# Altium project stepmotor.PrjPcb
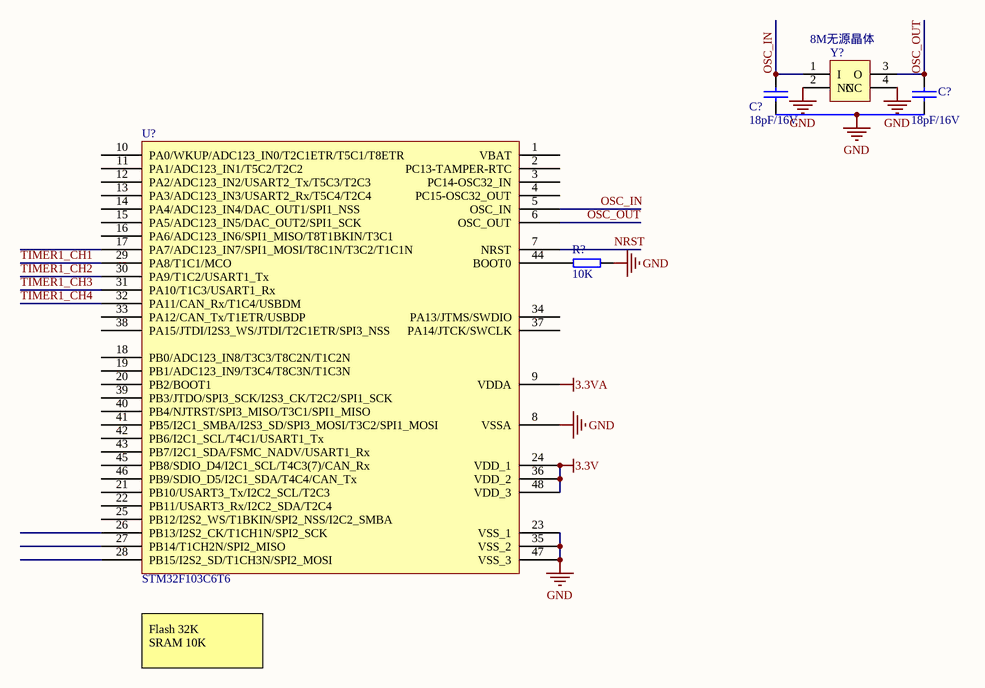
[diagram p0: mcu.SchDoc]
2 sheets, 34 parts. Net scope: global (net labels, ports and power ports of the same name join across sheets).
Sheets:
  mcu.SchDoc
  power.SchDoc

## Sheet mcu.SchDoc
size A3; SheetNumber: 1; SheetTotal: 2

### Parts
(Parts that share a designator on the sheet are numbered #1, #2 ... from top to bottom, then left to right.)
C?#1  18pF/16V  [C0402]
C?#2  18pF/16V  [C0402]
R?#1  10K  [R0603]
U?#1  STM32F103C6T6  [LQFP-48_M]
Y?  8M无源晶体  [5032 4pin]

### Nets
3.3V: U?#1.24(VDD_1) U?#1.36(VDD_2) U?#1.48(VDD_3)
3.3VA: U?#1.9(VDDA)
GND: C?#1.1 C?#2.1 R?#1.1 U?#1.8(VSSA) U?#1.23(VSS_1) U?#1.35(VSS_2) U?#1.47(VSS_3) Y?.2(NC) Y?.4(NC)
NRST: U?#1.7(NRST)
OSC_IN: C?#1.2 U?#1.5(OSC_IN) Y?.1(I)
OSC_OUT: C?#2.2 U?#1.6(OSC_OUT) Y?.3(O)
TIMER1_CH1: U?#1.29(PA8/T1C1/MCO)
TIMER1_CH2: U?#1.30(PA9/T1C2/USART1_Tx)
TIMER1_CH3: U?#1.31(PA10/T1C3/USART1_Rx)
TIMER1_CH4: U?#1.32(PA11/CAN_Rx/T1C4/USBDM)
NetR?#1_2: R?#1.2 U?#1.44(BOOT0)

Not connected (* = marked no-connect by the designer): U?#1 1(VBAT) 2(PC13-TAMPER-RTC) 3(PC14-OSC32_IN) 4(PC15-OSC32_OUT) 10(PA0/WKUP/ADC123_IN0/T2C1ETR/T5C1/T8ETR) 11(PA1/ADC123_IN1/T5C2/T2C2) 12(PA2/ADC123_IN2/USART2_Tx/T5C3/T2C3) 13(PA3/ADC123_IN3/USART2_Rx/T5C4/T2C4) 14(PA4/ADC123_IN4/DAC_OUT1/SPI1_NSS) 15(PA5/ADC123_IN5/DAC_OUT2/SPI1_SCK) 16(PA6/ADC123_IN6/SPI1_MISO/T8T1BKIN/T3C1) 17(PA7/ADC123_IN7/SPI1_MOSI/T8C1N/T3C2/T1C1N) 18(PB0/ADC123_IN8/T3C3/T8C2N/T1C2N) 19(PB1/ADC123_IN9/T3C4/T8C3N/T1C3N) 20(PB2/BOOT1) 21(PB10/USART3_Tx/I2C2_SCL/T2C3) 22(PB11/USART3_Rx/I2C2_SDA/T2C4) 25(PB12/I2S2_WS/T1BKIN/SPI2_NSS/I2C2_SMBA) 26(PB13/I2S2_CK/T1CH1N/SPI2_SCK) 27(PB14/T1CH2N/SPI2_MISO) 28(PB15/I2S2_SD/T1CH3N/SPI2_MOSI) 33(PA12/CAN_Tx/T1ETR/USBDP) 34(PA13/JTMS/SWDIO) 37(PA14/JTCK/SWCLK) 38(PA15/JTDI/I2S3_WS/JTDI/T2C1ETR/SPI3_NSS) 39(PB3/JTDO/SPI3_SCK/I2S3_CK/T2C2/SPI1_SCK) 40(PB4/NJTRST/SPI3_MISO/T3C1/SPI1_MISO) 41(PB5/I2C1_SMBA/I2S3_SD/SPI3_MOSI/T3C2/SPI1_MOSI) 42(PB6/I2C1_SCL/T4C1/USART1_Tx) 43(PB7/I2C1_SDA/FSMC_NADV/USART1_Rx) 45(PB8/SDIO_D4/I2C1_SCL/T4C3(7)/CAN_Rx) 46(PB9/SDIO_D5/I2C1_SDA/T4C4/CAN_Tx)

### Notes on the sheet
- Flash 32K
  SRAM 10K

### Library data of the parts
C?#1 C?#2 = CAP: Capacitor
R?#1 = Resistance
U?#1 = STM32F103C: STM32单片机48引脚
Y? = OSC24

## Sheet power.SchDoc
size A4; SheetNumber: 2; SheetTotal: 2
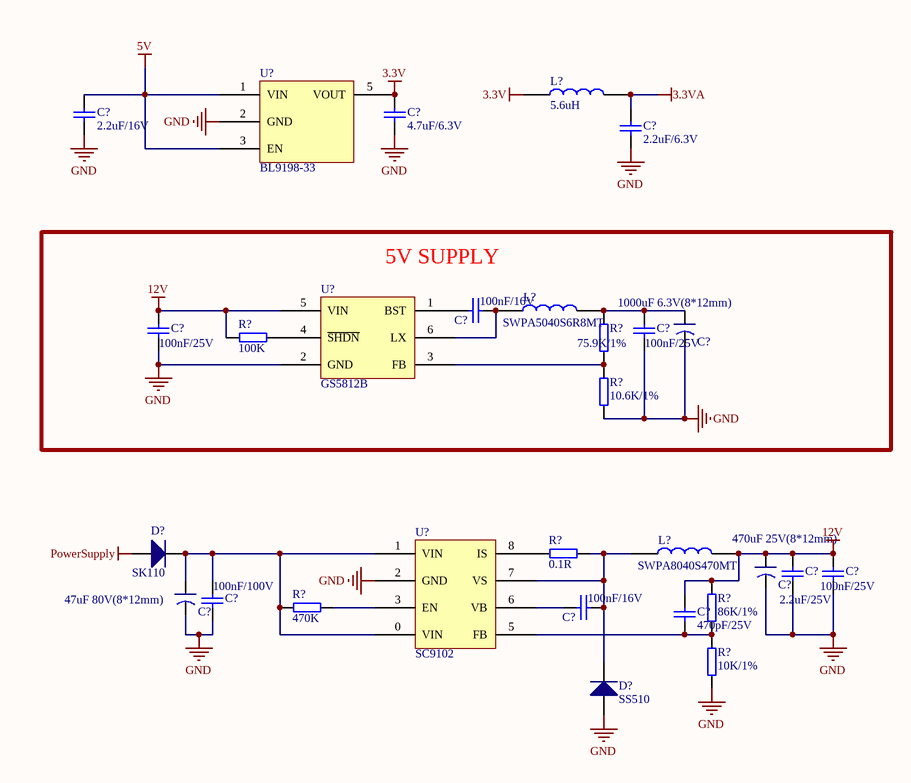
[diagram p1: power.SchDoc]

### Parts
(Parts that share a designator on the sheet are numbered #1, #2 ... from top to bottom, then left to right.)
C?#3  2.2uF/16V  [C0603]
C?#4  4.7uF/6.3V  [C0603]
C?#5  2.2uF/6.3V  [C0402]
C?#6  100nF/16V  [C0402]
C?#7  1000uF 6.3V(8*12mm)  [AL-ELEC 8*12mm]
C?#8  100nF/25V  [C0603]
C?#9  100nF/25V  [C0603]
C?#10  470uF 25V(8*12mm)  [AL-ELEC 8*12mm]
C?#11  2.2uF/25V  [C0603]
C?#12  100nF/25V  [C0603]
C?#13  47uF 80V(8*12mm)  [AL-ELEC 8*12mm]
C?#14  100nF/16V  [C0402]
C?#15  100nF/100V  [C1206]
C?#16  470pF/25V  [C0603]
D?#1  SK110  [DO-214AC SMA]
D?#2  SS510  [DO-214AC SMA]
L?#1  5.6uH  [L0402]
L?#2  SWPA5040S6R8MT  [SWPA5040S]
L?#3  SWPA8040S470MT  [SWPA8040S]
R?#2  100K  [R0603]
R?#3  75.9K/1%  [R0603]
R?#4  10.6K/1%  [R0603]
R?#5  0.1R  [R1206]
R?#6  470K  [R0603]
R?#7  86K/1%  [R0603]
R?#8  10K/1%  [R0603]
U?#2  BL9198-33  [SOT-23(5)]
U?#3  GS5812B  [SOT-23(6)]
U?#4  SC9102  [SOIC-8 EP]

### Blocks framed on the sheet
5V SUPPLY: C?#6-C?#9 L?#2 R?#2-R?#4 U?#3

### Nets
3.3V: C?#4.2 L?#1.1 U?#2.5(VOUT)
3.3VA: C?#5.2 L?#1.2
5V: C?#3.2 U?#2.1(VIN) U?#2.3(EN)
12V: C?#8.2 C?#10.1 C?#11.2 C?#12.2 C?#16.2 L?#3.2 R?#2.1 R?#7.2 U?#3.5(VIN)
GND: C?#3.1 C?#4.1 C?#5.1 C?#7.2 C?#8.1 C?#9.1 C?#10.2 C?#11.1 C?#12.1 C?#13.2 C?#15.1 D?#2.1 R?#4.1 R?#8.1 U?#2.2(GND) U?#3.2(GND) U?#4.2(GND)
PowerSupply: D?#1.1
NetC?#6_1: C?#6.1 L?#2.1 U?#3.6(LX)
NetC?#6_2: C?#6.2 U?#3.1(BST)
NetC?#7_1: C?#7.1 C?#9.2 L?#2.2 R?#3.2
NetC?#13_1: C?#13.1 C?#15.2 D?#1.2 R?#6.1 U?#4.0(VIN) U?#4.1(VIN)
NetC?#14_1: C?#14.1 D?#2.2 L?#3.1 R?#5.2 U?#4.7(VS)
NetC?#14_2: C?#14.2 U?#4.6(VB)
NetC?#16_1: C?#16.1 R?#7.1 R?#8.2 U?#4.5(FB)
NetR?#2_2: R?#2.2 U?#3.4(~{SHDN})
NetR?#3_1: R?#3.1 R?#4.2 U?#3.3(FB)
NetR?#5_1: R?#5.1 U?#4.8(IS)
NetR?#6_2: R?#6.2 U?#4.3(EN)

### Library data of the parts
C?#3-C?#5 C?#8 C?#9 C?#11 C?#12 C?#15 C?#16 = cap
C?#6 C?#14 = CAP: Capacitor
C?#7 C?#10 C?#13 = Capacitor: 铝电解电容
D?#1 D?#2 = Diode
L?#1 = INDUCTOR: 贴片电感
L?#2 L?#3 = INDUCTOR: 顺络 47uH
R?#2-R?#8 = Resistance
U?#2 = BL9161
U?#3 = GS5812B: 中广芯源

## Nets that join several sheets
3.3V: mcu (U?#1.24 U?#1.36 U?#1.48), power (C?#4.2 L?#1.1 U?#2.5)
3.3VA: mcu (U?#1.9), power (C?#5.2 L?#1.2)
GND: mcu (9 pins), power (17 pins)